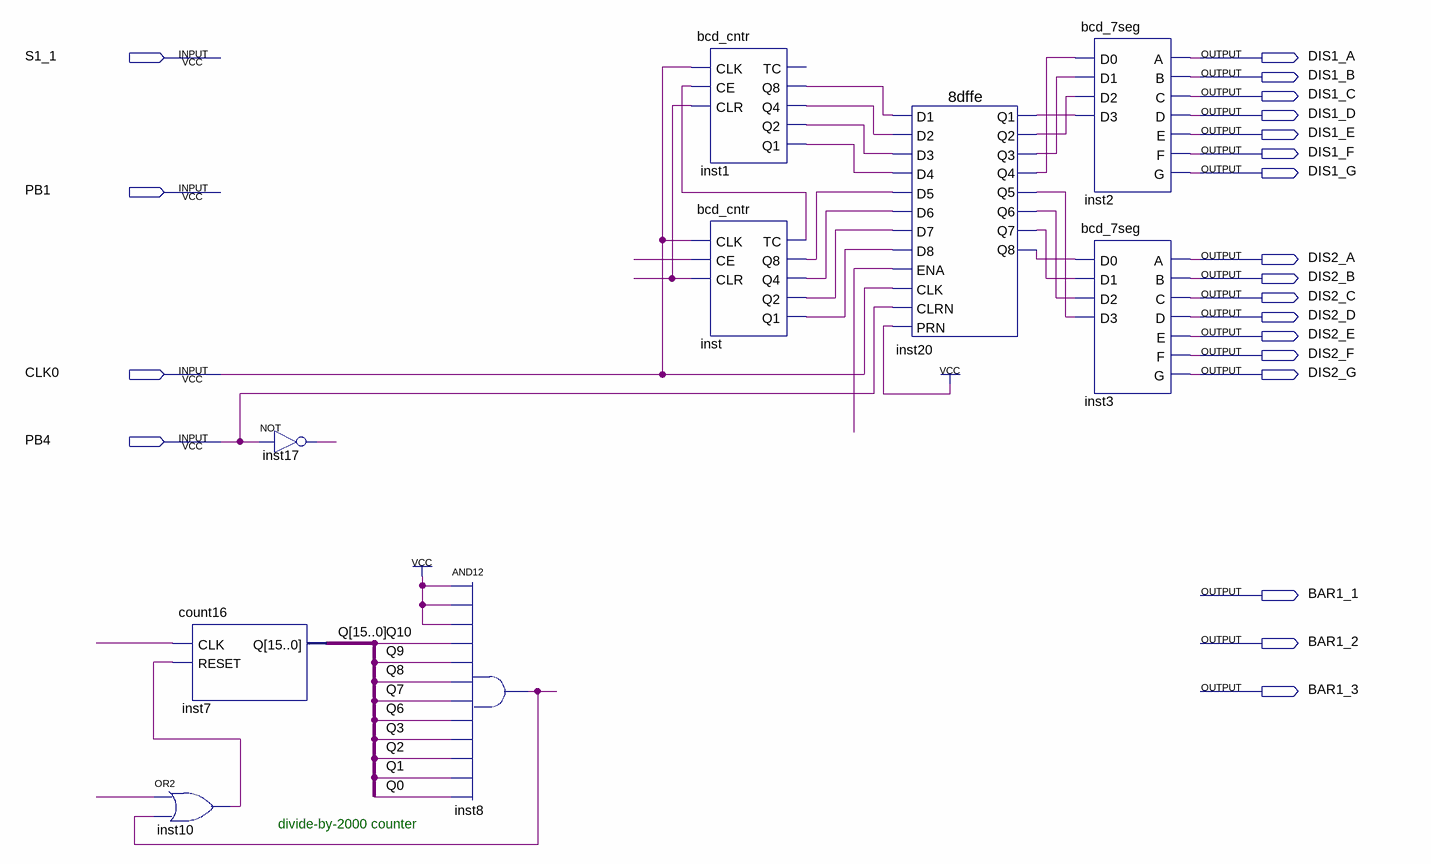
[diagram p0: schematic sheet]
// Quartus schematic freqcnt.bdf as structural Verilog: 9 symbols, 21 pins
module freqcnt (
  input  S1_1,
  input  PB1,
  input  CLK0,
  input  PB4,
  output DIS1_A,
  output DIS1_B,
  output DIS1_C,
  output DIS1_D,
  output DIS1_E,
  output DIS1_F,
  output DIS1_G,
  output DIS2_A,
  output DIS2_B,
  output DIS2_C,
  output DIS2_D,
  output DIS2_E,
  output DIS2_F,
  output DIS2_G,
  output BAR1_1,
  output BAR1_2,
  output BAR1_3
);

  wire inst1_q1, inst1_q2, inst1_q4, inst1_q8, inst8_out, inst10_out, inst17_out, inst20_q1, inst20_q2,
       inst20_q3, inst20_q4, inst20_q5, inst20_q6, inst20_q7, inst20_q8, inst_q1, inst_q2, inst_q4, inst_q8,
       inst_tc, undriven, undriven_2, undriven_3, undriven_4, undriven_5;
  wire [15:0] Q;

  or inst10 (inst10_out, undriven, inst8_out);
  count16 inst7 (.CLK(undriven_2), .RESET(inst10_out), .Q(Q));
  not inst17 (inst17_out, PB4);
  and inst8 (inst8_out, 1'b1, 1'b1, 1'b1, Q[10], Q[9], Q[8], Q[7], Q[6], Q[3], Q[2], Q[1], Q[0]);
  bcd_cntr inst1 (
    .CLK(CLK0), .CE(inst_tc), .CLR(undriven_3), .Q8(inst1_q8), .Q4(inst1_q4), .Q2(inst1_q2), .Q1(inst1_q1));  // open: TC
  bcd_cntr inst (
    .CLK(CLK0), .CE(undriven_5), .CLR(undriven_3), .TC(inst_tc), .Q8(inst_q8), .Q4(inst_q4), .Q2(inst_q2),
    .Q1(inst_q1));
  \8dffe  inst20 (
    .CLRN(PB4), .D2(inst1_q4), .D3(inst1_q2), .D4(inst1_q1), .D5(inst_q8), .D8(inst_q1), .D6(inst_q4),
    .D7(inst_q2), .CLK(CLK0), .ENA(undriven_4), .D1(inst1_q8), .PRN(1'b1), .Q8(inst20_q8), .Q4(inst20_q4),
    .Q6(inst20_q6), .Q7(inst20_q7), .Q3(inst20_q3), .Q2(inst20_q2), .Q1(inst20_q1), .Q5(inst20_q5));
  bcd_7seg inst2 (
    .D0(inst20_q4), .D1(inst20_q3), .D2(inst20_q2), .D3(inst20_q1), .A(DIS1_A), .B(DIS1_B), .C(DIS1_C),
    .D(DIS1_D), .E(DIS1_E), .F(DIS1_F), .G(DIS1_G));
  bcd_7seg inst3 (
    .D0(inst20_q8), .D1(inst20_q7), .D2(inst20_q6), .D3(inst20_q5), .A(DIS2_A), .B(DIS2_B), .C(DIS2_C),
    .D(DIS2_D), .E(DIS2_E), .F(DIS2_F), .G(DIS2_G));

  // Notes on the sheet:
  //   divide-by-2000 counter
endmodule
